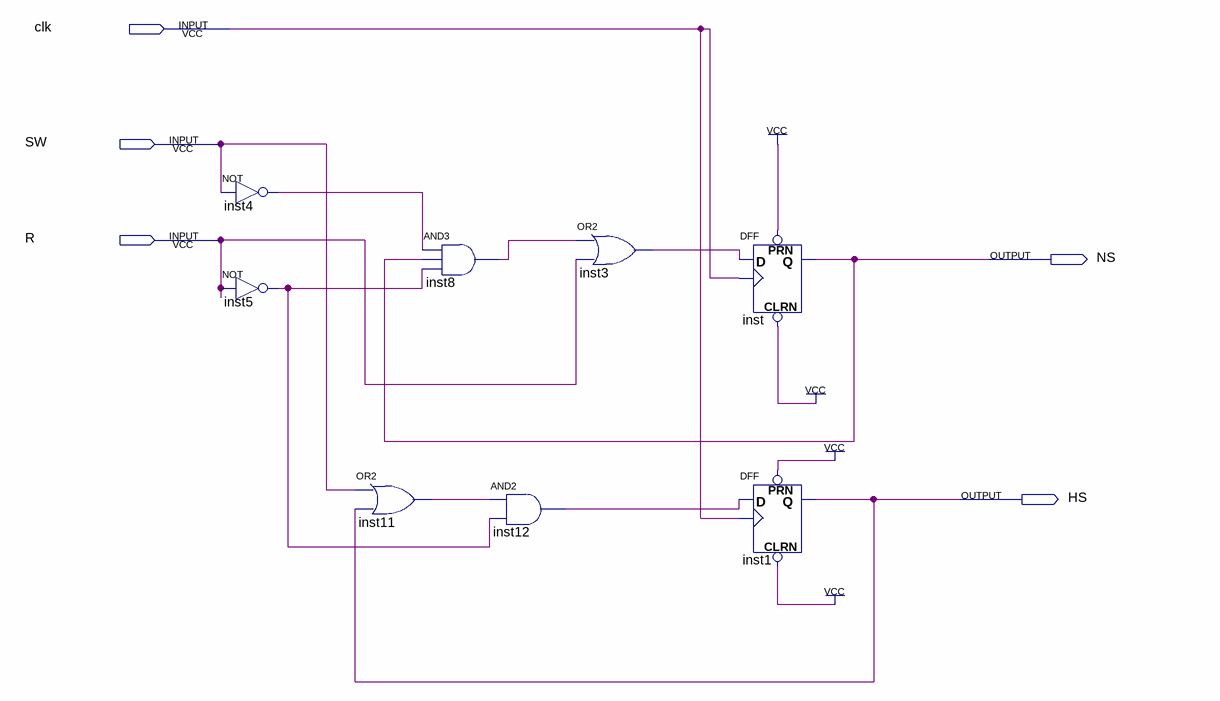
[diagram p0: schematic sheet]
// Quartus schematic lab04_vs.bdf as structural Verilog: 8 symbols, 5 pins
module lab04_vs (
  input  clk,
  input  SW,
  input  R,
  output NS,
  output HS
);

  wire inst3_out, inst4_out, inst5_out, inst8_out, inst11_out, inst12_out;

  not inst4 (inst4_out, SW);
  not inst5 (inst5_out, R);
  or inst11 (inst11_out, SW, HS);
  and inst8 (inst8_out, inst4_out, NS, inst5_out);
  and inst12 (inst12_out, inst11_out, inst5_out);
  or inst3 (inst3_out, inst8_out, R);
  DFF inst (.CLRN(1'b1), .CLK(clk), .D(inst3_out), .PRN(1'b1), .Q(NS));
  DFF inst1 (.CLRN(1'b1), .CLK(clk), .D(inst12_out), .PRN(1'b1), .Q(HS));
endmodule
